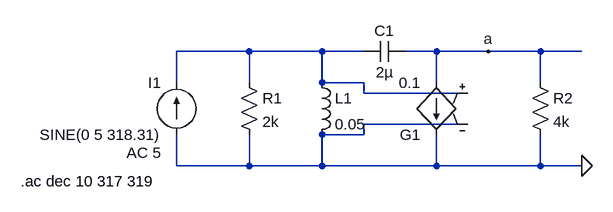
[diagram p0: schematic Task3.asc]
Task3.asc, the LTspice schematic file:
Version 4
SHEET 1 880 680
WIRE 256 64 144 64
WIRE 368 64 256 64
WIRE 432 64 368 64
WIRE 544 64 496 64
WIRE 624 64 544 64
WIRE 704 64 624 64
WIRE 768 64 704 64
WIRE 144 112 144 64
WIRE 256 112 256 64
WIRE 368 112 368 64
WIRE 432 112 368 112
WIRE 544 112 544 64
WIRE 704 112 704 64
WIRE 432 128 432 112
WIRE 592 128 432 128
WIRE 592 176 432 176
WIRE 432 192 432 176
WIRE 432 192 368 192
WIRE 144 240 144 192
WIRE 256 240 256 192
WIRE 256 240 144 240
WIRE 368 240 368 192
WIRE 368 240 256 240
WIRE 544 240 544 192
WIRE 544 240 368 240
WIRE 704 240 704 192
WIRE 704 240 544 240
WIRE 768 240 704 240
FLAG 768 240 0
FLAG 624 64 a
SYMBOL current 144 192 R180
WINDOW 0 24 80 Left 2
WINDOW 3 24 0 Left 2
WINDOW 123 24 -28 Left 2
WINDOW 39 0 0 Left 0
SYMATTR InstName I1
SYMATTR Value SINE(0 5 318.31)
SYMATTR Value2 AC 5
SYMBOL res 240 96 R0
SYMATTR InstName R1
SYMATTR Value 2k
SYMBOL ind 352 96 R0
SYMATTR InstName L1
SYMATTR Value 0.05
SYMBOL cap 496 48 R90
WINDOW 0 0 32 VBottom 2
WINDOW 3 32 32 VTop 2
SYMATTR InstName C1
SYMATTR Value 2µ
SYMBOL res 688 96 R0
SYMATTR InstName R2
SYMATTR Value 4k
SYMBOL g2 544 208 R180
SYMATTR InstName G1
SYMATTR Value 0.1
TEXT -96 264 Left 2 !.ac dec 10 317 319

The netlist it stands for:
* Task3.asc
I1 0 N001 SINE(0 5 318.31) AC 5
R1 N001 0 2k
L1 N001 0 0.05
C1 a N001 2µ
R2 a 0 4k
G1 a 0 N001 0 0.1
.ac dec 10 317 319
.backanno
.end

* Results of the author's LTspice run, read from the files saved beside the schematic
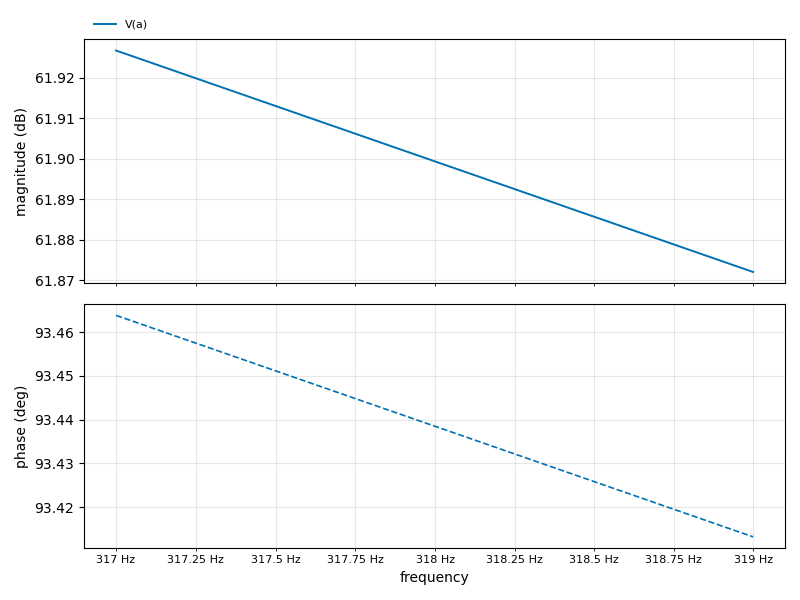
[diagram p1: AC Analysis of Task3.asc, plotted from the saved traces]
* AC Analysis, 1 run:
*   V(a): 61.93 dB at 317 Hz, 61.87 dB at 319 Hz, peak 61.93 dB at 317 Hz